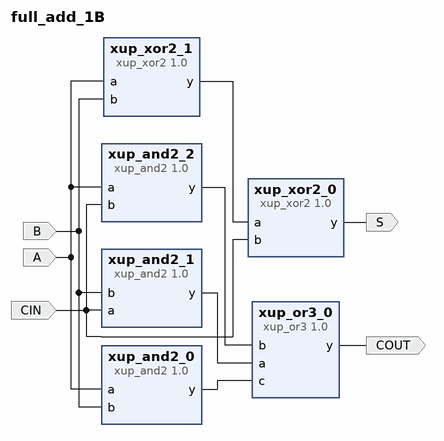
[diagram p0: block diagram of the top level]
# Vivado block design full_add_1B, xc7a100tcsg324-1, Vivado 2019.1
create_bd_design full_add_1B

create_bd_port -dir I A
create_bd_port -dir I B
create_bd_port -dir I CIN
create_bd_port -dir O S
create_bd_port -dir O COUT

create_bd_cell -type ip -vlnv xilinx.com:xup:xup_and2:1.0 xup_and2_1
create_bd_cell -type ip -vlnv xilinx.com:xup:xup_and2:1.0 xup_and2_2
create_bd_cell -type ip -vlnv xilinx.com:xup:xup_or3:1.0 xup_or3_0
create_bd_cell -type ip -vlnv xilinx.com:xup:xup_xor2:1.0 xup_xor2_0
create_bd_cell -type ip -vlnv xilinx.com:xup:xup_xor2:1.0 xup_xor2_1
create_bd_cell -type ip -vlnv xilinx.com:xup:xup_and2:1.0 xup_and2_0

# ---- connections ----

connect_bd_net [get_bd_pins xup_and2_2/y] [get_bd_pins xup_or3_0/b]
connect_bd_net [get_bd_pins xup_and2_1/y] [get_bd_pins xup_or3_0/a]
connect_bd_net [get_bd_pins xup_xor2_1/y] [get_bd_pins xup_xor2_0/a]
connect_bd_net [get_bd_pins xup_or3_0/y] [get_bd_ports COUT]
connect_bd_net [get_bd_pins xup_xor2_0/y] [get_bd_ports S]
connect_bd_net [get_bd_ports A] [get_bd_pins xup_xor2_1/a] [get_bd_pins xup_and2_2/a] [get_bd_pins xup_and2_0/a]
connect_bd_net [get_bd_ports B] [get_bd_pins xup_xor2_1/b] [get_bd_pins xup_and2_1/b] [get_bd_pins xup_and2_0/b]
connect_bd_net [get_bd_ports CIN] [get_bd_pins xup_xor2_0/b] [get_bd_pins xup_and2_1/a] [get_bd_pins xup_and2_2/b]
connect_bd_net [get_bd_pins xup_and2_0/y] [get_bd_pins xup_or3_0/c]

validate_bd_design
save_bd_design
